# Altium schematic sheet 8BIT_LED.SchDoc
size A4
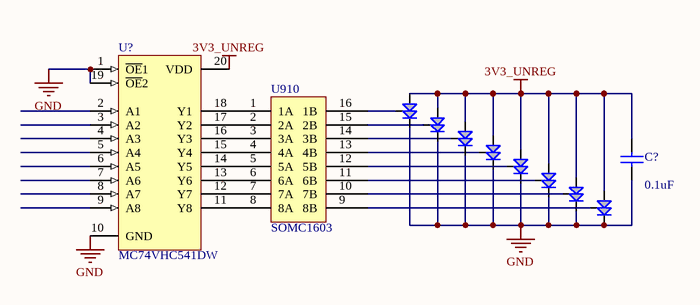
[diagram p0: 8BIT_LED.SchDoc]

## Parts
(Parts that share a designator on the sheet are numbered #1, #2 ... from top to bottom, then left to right.)
C?  value 0.1uF  [6-0805_M]  (hidden comment: Cap)
LED?#1  BIDIRECTIONAL LED  (value not drawn)
LED?#2  BIDIRECTIONAL LED  (value not drawn)
LED?#3  BIDIRECTIONAL LED  (value not drawn)
LED?#4  BIDIRECTIONAL LED  (value not drawn)
LED?#5  BIDIRECTIONAL LED  (value not drawn)
LED?#6  BIDIRECTIONAL LED  (value not drawn)
LED?#7  BIDIRECTIONAL LED  (value not drawn)
LED?#8  BIDIRECTIONAL LED  (value not drawn)
U910  SOMC1603  [SOMC1603]
U?  MC74VHC541DW  [751D-04_M]

## Nets
3V3_UNREG: C?.2 LED?#1.3(VCC) LED?#2.3(VCC) LED?#3.3(VCC) LED?#4.3(VCC) LED?#5.3(VCC) LED?#6.3(VCC) LED?#7.3(VCC) LED?#8.3(VCC) U?.20(VDD)
GND: C?.1 LED?#1.1(GND) LED?#2.1(GND) LED?#3.1(GND) LED?#4.1(GND) LED?#5.1(GND) LED?#6.1(GND) LED?#7.1(GND) LED?#8.1(GND) U?.1(~{OE}1) U?.10(GND) U?.19(~{OE}2)
NetLED?#1_2: LED?#1.2(RES) U910.16(1B)
NetLED?#2_2: LED?#2.2(RES) U910.15(2B)
NetLED?#3_2: LED?#3.2(RES) U910.14(3B)
NetLED?#4_2: LED?#4.2(RES) U910.13(4B)
NetLED?#5_2: LED?#5.2(RES) U910.12(5B)
NetLED?#6_2: LED?#6.2(RES) U910.11(6B)
NetLED?#7_2: LED?#7.2(RES) U910.10(7B)
NetLED?#8_2: LED?#8.2(RES) U910.9(8B)
NetU910_1: U910.1(1A) U?.18(Y1)
NetU910_2: U910.2(2A) U?.17(Y2)
NetU910_3: U910.3(3A) U?.16(Y3)
NetU910_4: U910.4(4A) U?.15(Y4)
NetU910_5: U910.5(5A) U?.14(Y5)
NetU910_6: U910.6(6A) U?.13(Y6)
NetU910_7: U910.7(7A) U?.12(Y7)
NetU910_8: U910.8(8A) U?.11(Y8)

Not connected (* = marked no-connect by the designer): U? 2(A1) 3(A2) 4(A3) 5(A4) 6(A5) 7(A6) 8(A7) 9(A8)

## Library data of the parts
C? = Cap: Capacitor; Published: 8-Jun-2000; LatestRevisionDate: 17-Jul-2002; LatestRevisionNote: Re-released for DXP Platform.; PackageReference: RAD-0.3; Publisher: Altium Limited; PackageDescription: Radial Cap, Thru-Hole; 2 Leads; 0.3 in Pin Spacing
U? = MC74VHC541DW: Octal Bus Buffer; Published: 15-Apr-2002; LatestRevisionDate: 13-Apr-2006; LatestRevisionNote: IPC-7351 Footprint Added.; DatasheetVersion: 1998; PackageReference: 751D-04; Publisher: Altium Limited; PackageDescription: 20-Pin Small Outline Integrated Circuit 1.27 mm Pitch; ComponentLink1Description: Manufacturer Link; ComponentLink1URL: http://www.onsemi.com/; ComponentLink2Description: Datasheet; ComponentLink2URL: http://www.onsemi.com/pub/Collateral/MC74VHC541-D.PDF